# Altium project ELEC-URB-CANACC-R2.0A2.PrjPcb
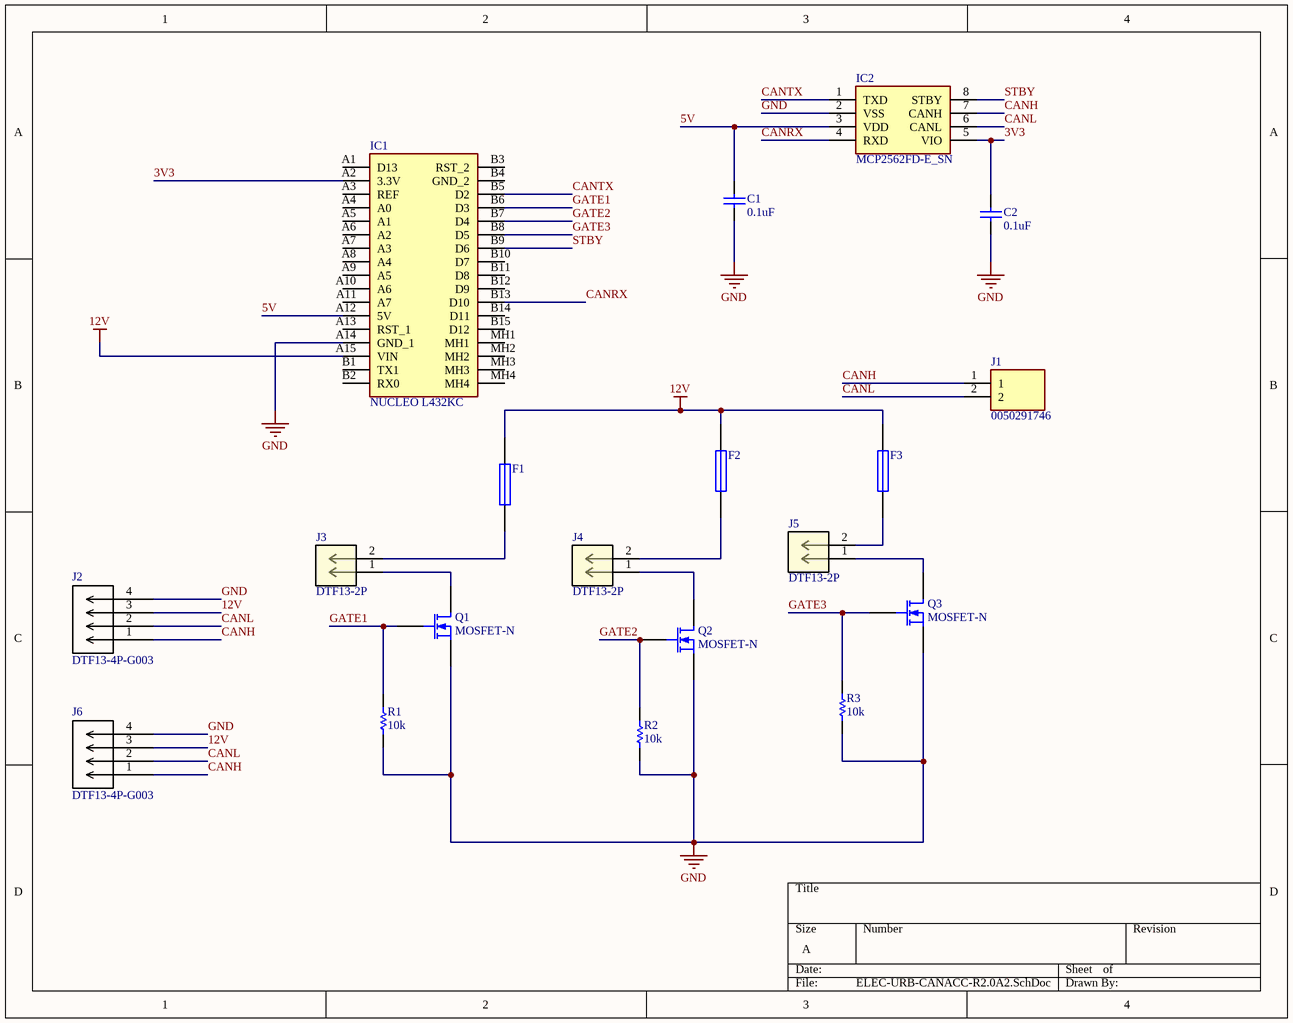
[diagram p0: ELEC-URB-CANACC-R2.0A2.SchDoc]
1 sheet, 19 parts. Net scope: global (net labels, ports and power ports of the same name join across sheets).
Board file: ELEC-URB-CANACC-R2.0A2.PcbDoc

## Sheet ELEC-URB-CANACC-R2.0A2.SchDoc
size A

### Parts
C1  0.1uF  [0603C]
C2  0.1uF  [0603C]
F1  Small Fuse  [SML FUSE HOLDER]  (value not drawn)
F2  Small Fuse  [SML FUSE HOLDER]  (value not drawn)
F3  Small Fuse  [SML FUSE HOLDER]  (value not drawn)
IC1  NUCLEO L432KC  [ABX00028]
IC2  MCP2562FD-E_SN  [SOIC127P600X175-8N]
J1  0050291746  [SHDR2W87P0X254_1X2_493X635X1044P]
J2  DTF13-4P-G003  [CONN4_DTF13-4P]
J3  DTF13-2P  [CONN2_DTF13-2P]
J4  DTF13-2P  [CONN2_DTF13-2P]
J5  DTF13-2P  [CONN2_DTF13-2P]
J6  DTF13-4P-G003  [CONN4_DTF13-4P]
Q1  MOSFET-N  [Diode Mosfet]
Q2  MOSFET-N  [Diode Mosfet]
Q3  MOSFET-N  [Diode Mosfet]
R1  10k  [0603R]
R2  10k  [0603R]
R3  10k  [0603R]

### Nets
12V: F1.1 F2.2 F3.2 IC1.A15(VIN) J2.3 J6.3
GND: C1.2 C2.1 IC1.A14(GND_1) IC2.2(VSS) J2.4 J6.4 Q1.3(S) Q2.3(S) Q3.3(S) R1.1 R2.1 R3.1
3V3: C2.2 IC1.A2(3.3V) IC2.5(VIO)
5V: C1.1 IC1.A12(5V) IC2.3(VDD)
CANH: IC2.7(CANH) J1.1 J2.1 J6.1
CANL: IC2.6(CANL) J1.2 J2.2 J6.2
CANRX: IC1.B13(D10) IC2.4(RXD)
CANTX: IC1.B5(D2) IC2.1(TXD)
GATE1: IC1.B6(D3) Q1.2(G) R1.2
GATE2: IC1.B7(D4) Q2.2(G) R2.2
GATE3: IC1.B8(D5) Q3.2(G) R3.2
STBY: IC1.B9(D6) IC2.8(STBY)
NetF1_2: F1.2 J3.2
NetF2_1: F2.1 J4.2
NetF3_1: F3.1 J5.2
NetJ3_1: J3.1 Q1.1(D)
NetJ4_1: J4.1 Q2.1(D)
NetJ5_1: J5.1 Q3.1(D)

Not connected (* = marked no-connect by the designer): IC1 A1(D13) A3(REF) A4(A0) A5(A1) A6(A2) A7(A3) A8(A4) A9(A5) A10(A6) A11(A7) A13(RST_1) B1(TX1) B2(RX0) B3(RST_2) B4(GND_2) B10(D7) B11(D8) B12(D9) B14(D11) B15(D12) MH1 MH2 MH3 MH4

### Library data of the parts
C1 C2 = Cap 0.1uF: Capacitor 0.1uF 16V; Value: 1uF; Revision: July-2002: Re-released for DXP Platform.
F1-F3 = Fuse 1: Fuse; Published: 8-Jun-2000; LatestRevisionDate: 17-Jul-2002; LatestRevisionNote: Re-released for DXP Platform.; PackageReference: PIN-W2/E2.8; Publisher: Altium Limited; PackageDescription: Thru-Hole; 2 Leads
IC1 = NUCLEO L432KC Arduino Nano Pinout: Integrated Circuit; Datasheet Link: https://store.arduino.cc/arduino-nano-every; Height: 10mm; Manufacturer_Name: Arduino; Manufacturer_Part_Number: ABX00028; Mouser Part Number: 782-ABX00028; Mouser Price/Stock: https://www.mouser.com/Search/Refine.aspx?Keyword=782-ABX00028
IC2 = MCP2562FD-E_SN: Integrated Circuit; Manufacturer_Name: Microchip; Manufacturer_Part_Number: MCP2562FD-E/SN; Allied_Number: 70431558; Datasheet Link: http://uk.rs-online.com/web/p/products/8243123; Height: 1.75mm; Mouser Part Number: 579-MCP2562FD-E/SN; Mouser Price/Stock: https://www.mouser.com/Search/Refine.aspx?Keyword=579-MCP2562FD-E%2FSN; RS Part Number: 8243123P; RS Price/Stock: http://uk.rs-online.com/web/p/products/8243123P; Allied Price/Stock: https://www.alliedelec.com/microchip-technology-inc-mcp2562fd-e-sn/70431558/
J1 = 0050291746: Connector; Manufacturer_Name: Molex; Datasheet Link: http://www.molex.com/pdm_docs/sd/050291746_sd.pdf; Height: 10.44mm; Manufacturer_Part_Number: 0050291746
J2 J6 = DTF13-4P-G003: DTF RECP ASM; Built_By: EMA_Justin; Vendor: TE Connectivity; ROWS/CONFIG: 2; PITCH(MM): 0.175; POSITIONS: 4; Copyright: Copyright (C) 2016 Accelerated Designs. All rights reserved; Manufacturer_Part_Number: DTF13-4P-G003; TE_Part_Number: DTF13-4P-G003; PRODUCT: -; Type: DEV; Datasheet: https://www.te.com/commerce/DocumentDelivery/DDEController?Action=showdoc&DocId=Customer+Drawing%7FDTF13-4P-G003%7FA%7Fpdf%7FEnglish%7FENG_CD_DTF13-4P-G003_A.pdf%7FDTF13-4P-G003; RefDes: RefDes; Value: Value
J3-J5 = DTF13-2P: DTF RECP ASM; POSITIONS: 2; PITCH(MM): 0.215; ROWS/CONFIG: 1; Built_By: EMA_Justin; Vendor: TE Connectivity; Type: DEV; PRODUCT: -; TE_Part_Number: DTF13-2P; Copyright: Copyright (C) 2016 Accelerated Designs. All rights reserved; Manufacturer_Part_Number: DTF13-2P; Datasheet: https://www.te.com/commerce/DocumentDelivery/DDEController?Action=srchrtrv&DocNm=DTF13-2P&DocType=Customer+Drawing&DocLang=English&DocFormat=pdf&PartCntxt=DTF13-2P; RefDes: RefDes; Value: Value
Q1-Q3 = MOSFET-N: N-Channel MOSFET; Published: 8-Jun-2000; LatestRevisionDate: 17-Jul-2002; LatestRevisionNote: Re-released for DXP Platform.; PackageVersion: 1995/1996; PackageReference: E3; Publisher: Altium Limited; PackageDescription: TO, Flat Index; 3 In-Line, Axial Leads; Body Dia. 4.6mm; Lead Dia. 0.5 mm (max)
R1-R3 = Res 10k: Resistor 10K; ComponentLink1URL: https://datasheet.ciiva.com/16511/aoa0000ce2-16511861.pdf?src-supplier=Avnet+Asia; ComponentLink1Description: https://datasheet.ciiva.com/16511/aoa0000ce2-16511861.pdf?src-supplier=Avnet+Asia; ComponentLink2URL: https://datasheet.ciiva.com/46372/1678782-46372725.pdf?src-supplier=Element14; ComponentLink2Description: https://datasheet.ciiva.com/46372/1678782-46372725.pdf?src-supplier=Element14; ComponentLink3URL: https://datasheet.ciiva.com/28514/426256-28514198.pdf?src-supplier=Element14; ComponentLink3Description: https://datasheet.ciiva.com/28514/426256-28514198.pdf?src-supplier=Element14; ComponentLink4URL: https://datasheet.ciiva.com/9194/aoa0000ce2-9194199.pdf?src-supplier=Avnet; ComponentLink4Description: https://datasheet.ciiva.com/9194/aoa0000ce2-9194199.pdf?src-supplier=Avnet; ComponentLink5URL: https://datasheet.ciiva.com/7830/aoa0000ce2-7830729.pdf?src-supplier=Element14; ComponentLink5Description: https://datasheet.ciiva.com/7830/aoa0000ce2-7830729.pdf?src-supplier=Element14; ComponentLink6URL: https://datasheet.ciiva.com/17212/aoa0000ce2-17212105.pdf?src-supplier=Avnet+Europe; ComponentLink6Description: https://datasheet.ciiva.com/17212/aoa0000ce2-17212105.pdf?src-supplier=Avnet+Europe; ComponentLink7URL: https://datasheet.ciiva.com/30208/aoa0000ce2-30208985.pdf?src-supplier=Onlinecomponents.com; ComponentLink7Description: https://datasheet.ciiva.com/30208/aoa0000ce2-30208985.pdf?src-supplier=Onlinecomponents.com; ComponentLink8URL: https://datasheet.ciiva.com/48530/aoa0000ce2-48530988.pdf?src-supplier=Avnet; ComponentLink8Description: https://datasheet.ciiva.com/48530/aoa0000ce2-48530988.pdf?src-supplier=Avnet; ComponentLink9URL: https://datasheet.ciiva.com/24070/aoa0000ce2-24070318.pdf?src-supplier=Mouser; ComponentLink9Description: https://datasheet.ciiva.com/24070/aoa0000ce2-24070318.pdf?src-supplier=Mouser; ComponentLink10URL: https://datasheet.ciiva.com/16759/70260748-16759807.pdf?src-supplier=Allied+Electronics; ComponentLink10Description: https://datasheet.ciiva.com/16759/70260748-16759807.pdf?src-supplier=Allied+Electronics